# Altium schematic sheet WanderDrive_Gate_Driver_2.SchDoc (part 2 of 2)
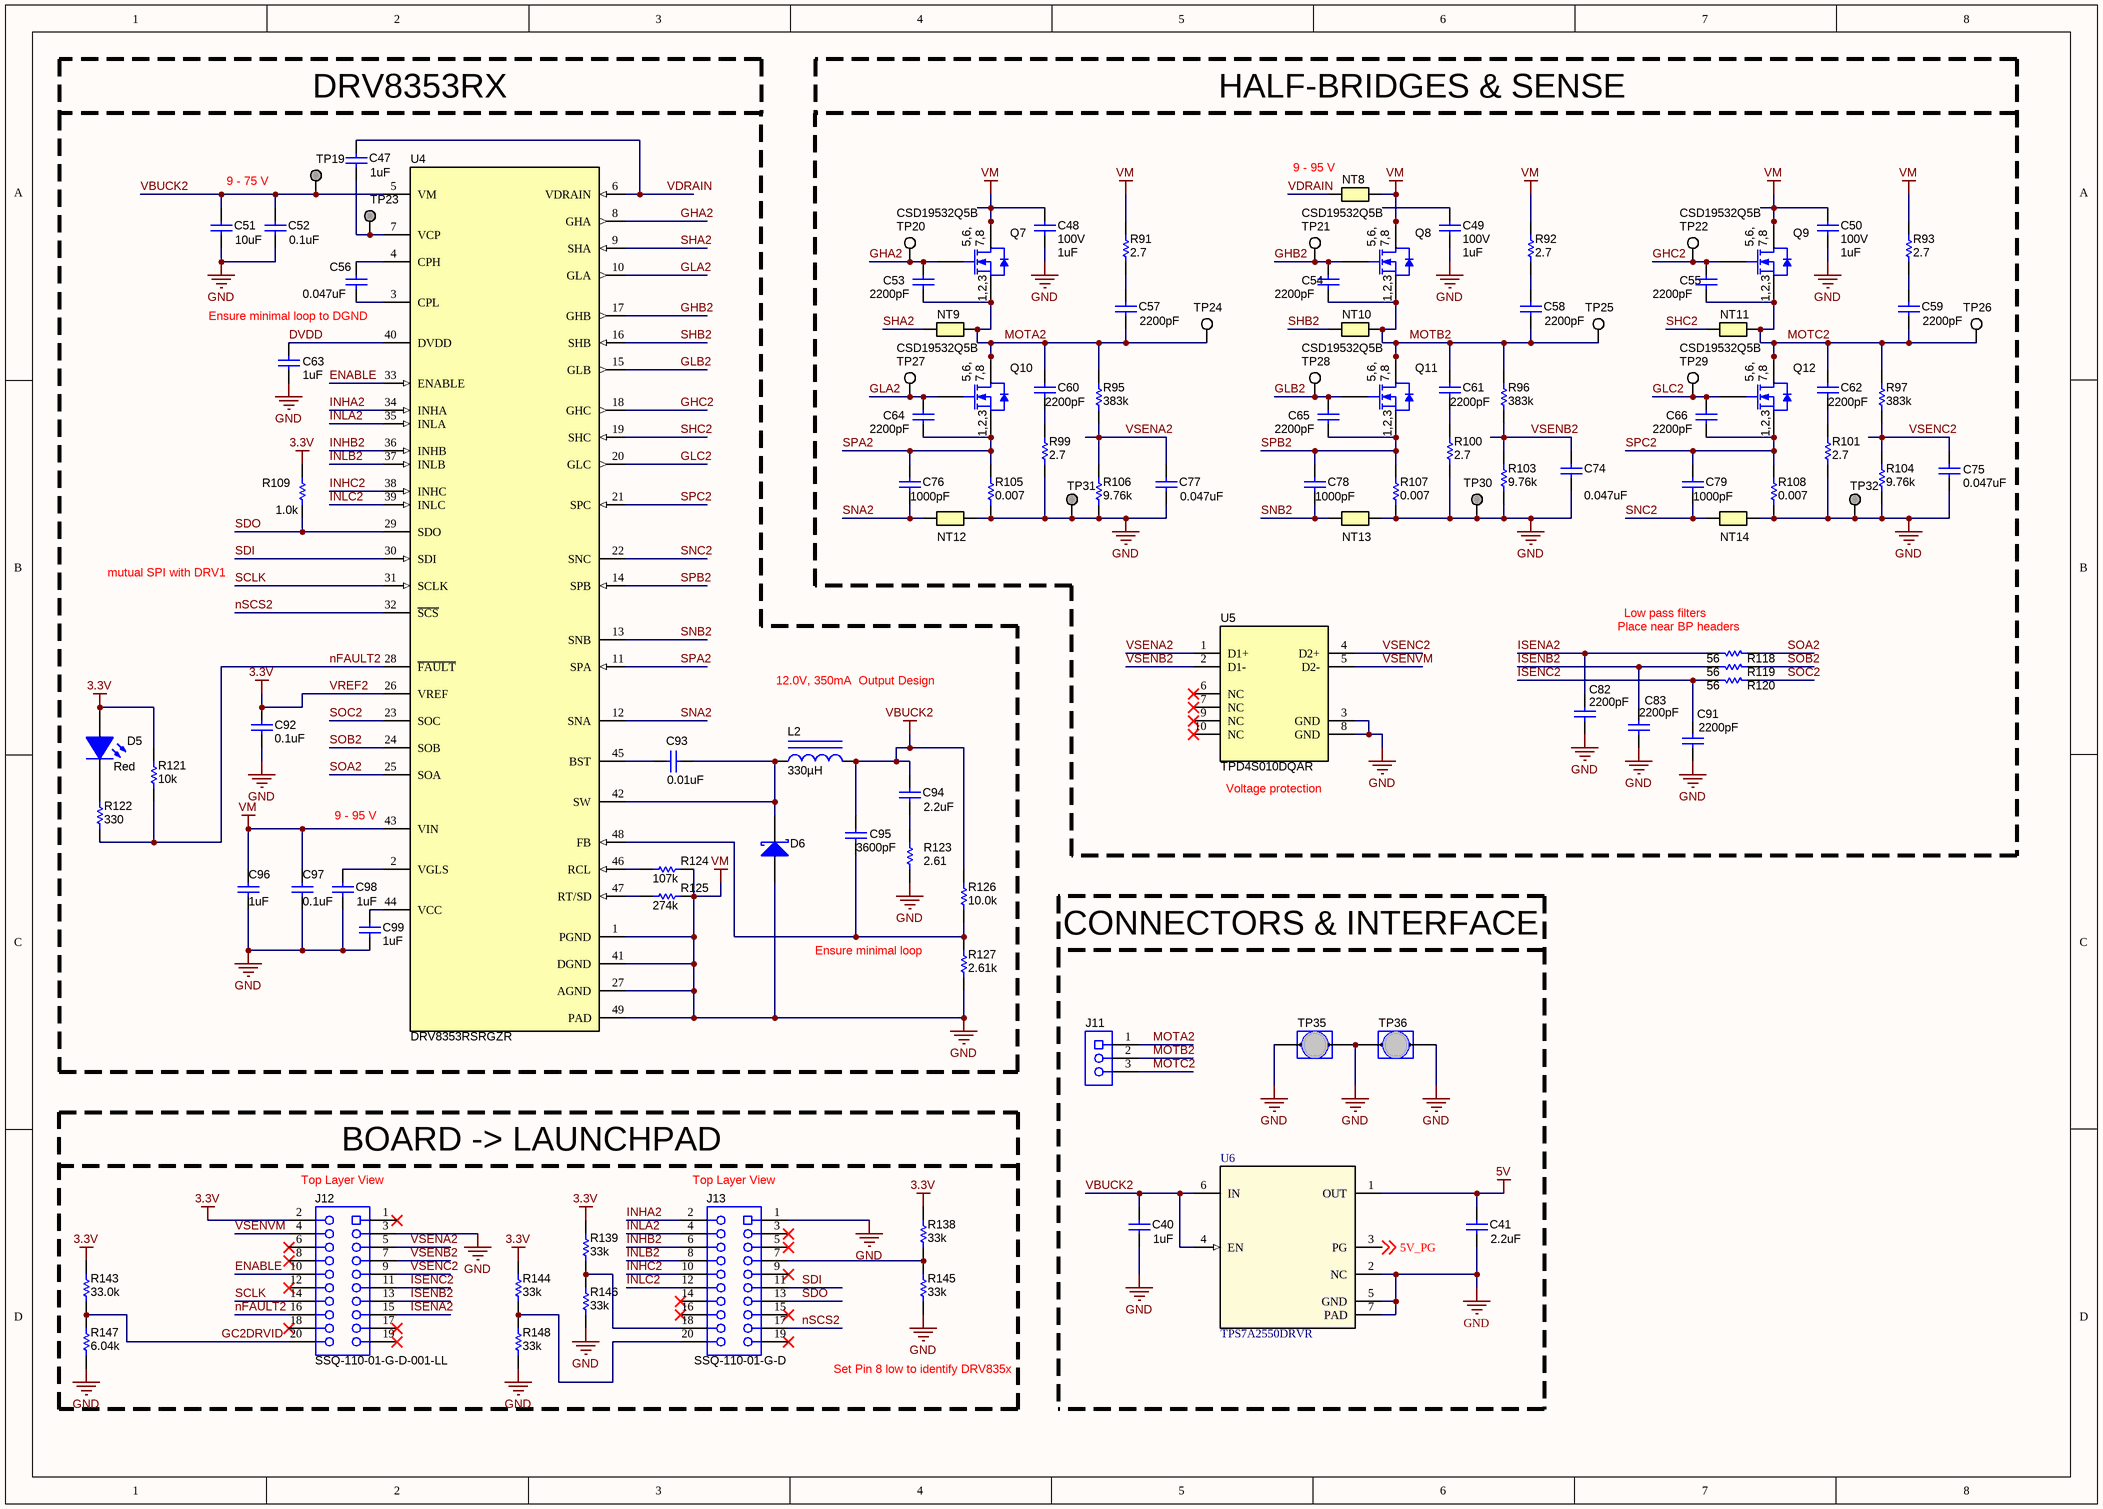
[diagram p1: WanderDrive_Gate_Driver_2.SchDoc]

## Library data of the parts
C40 = CMP-0007994-2: CAP, CERM, 1 uF, 50 V, +/- 10%, X7R, 0805; Manufacturer: Samsung Electro-Mechanics; TaMin_C: -55°C; Polarized: N; SizeAreaWB_mm2: 6.75; Value1: Unknown; U/M: EA; Value: 1uF; TaMax_C: 125°C; SizeZ_mm: 1.45; SizeX_mm: 2; SizeY_mm: 1.25; Cap_Case: 0805; Value2: 50V; SizeArea_mm2: 2.5; CompType: Capacitor; Cap_F: 1µF; AEC Category: Q200; Publisher: Texas Instruments; TempCo: X7R; Published: 2008-06-19; RoHS: Y; MountType: SMT; PackageReference: 0805; Tolerance_%: 10%; LatestRevisionDate: 2017-03-09; PartNumber: CL21B105KBFNNNE; AEC Qualified: ?; ComponentLink1Description: Datasheet link; Technology: Ceramic; ComponentLink1URL: http://www.samsungsem.com/servlet/FileDownload?type=spec&file=CL21B105KBFNNNE.pdf
C41 = CMP-0009230-2: CAP, CERM, 4.7 uF, 80 V, +/- 10%, X7R, 1210; Manufacturer: MuRata; TaMin_C: -55°C; Polarized: N; SizeAreaWB_mm2: 14.7; Value1: Unknown; U/M: EA; Value: 4.7uF; TaMax_C: 125°C; SizeZ_mm: 2.7; SizeX_mm: 3.2; SizeY_mm: 2.5; Cap_Case: 1210; Value2: 80V; SizeArea_mm2: 8; CompType: Capacitor; Cap_F: 4.7µF; AEC Category: Q200; Supplier Part Number 2: 81-GRM32ER71K475KE4L; Publisher: Texas Instruments; Supplier 2: Mouser; TempCo: X7R; Published: 2008-06-19; RoHS: Y; MountType: SMT; Supplier 1: Digi-Key; PackageReference: 1210; Tolerance_%: 10%; LatestRevisionDate: 2017-03-09; PartNumber: GRM32ER71K475KE14L; AEC Qualified: N; ComponentLink1Description: Datasheet link; AEC Grade: N/A; Supplier Part Number 1: 490-9972-1-ND; Technology: Ceramic; ComponentLink1URL: http://psearch.en.murata.com/capacitor/product/GRM32ER71K475KE14%23.pdf
C47 C96 = CMP-0008801-2: CAP, CERM, 1 uF, 100 V, +/- 10%, X7R, 1206; Manufacturer: Samsung; TaMin_C: -55°C; Polarized: N; SizeAreaWB_mm2: 10.92; Value1: Unknown; U/M: EA; Value: 1uF; TaMax_C: 125°C; SizeZ_mm: 1.8; SizeX_mm: 3.2; SizeY_mm: 1.6; Cap_Case: 1206; Value2: 100V; SizeArea_mm2: 5.12; CompType: Capacitor; Cap_F: 1µF; AEC Category: Q200; Publisher: Texas Instruments; TempCo: X7R; Published: 2008-06-19; RoHS: Y; MountType: SMT; Supplier 1: Digi-Key; PackageReference: 1206; Tolerance_%: 10%; LatestRevisionDate: 2017-03-09; PartNumber: CL31B105KCHNNNE; AEC Qualified: N; ComponentLink1Description: Datasheet link; AEC Grade: N/A; Supplier Part Number 1: 1276-1838-1-ND; Technology: Ceramic; ComponentLink1URL: http://www.samsungsem.com/kr/front/downloadcms.do?path=/kr/support/product-search/mlcc/__icsFiles/afieldfile/2014/11/05&fileName=C_CL31B105KCHNNNE.pdf
C48-C50 = CMP-0008801-2: CAP, CERM, 1 uF, 100 V, +/- 10%, X7R, 1206; Manufacturer: Samsung; TaMin_C: -55°C; Polarized: N; SizeAreaWB_mm2: 10.92; Value1: Unknown; U/M: EA; Value: 1uF; TaMax_C: 125°C; SizeZ_mm: 1.8; SizeX_mm: 3.2; SizeY_mm: 1.6; Cap_Case: 1206; SizeArea_mm2: 5.12; CompType: Capacitor; Cap_F: 1µF; AEC Category: Q200; Publisher: Texas Instruments; TempCo: X7R; Published: 2008-06-19; RoHS: Y; MountType: SMT; Supplier 1: Digi-Key; PackageReference: 1206; Tolerance_%: 10%; Value2: 100V; LatestRevisionDate: 2017-03-09; PartNumber: CL31B105KCHNNNE; AEC Qualified: N; ComponentLink1Description: Datasheet link; AEC Grade: N/A; Supplier Part Number 1: 1276-1838-1-ND; Technology: Ceramic; ComponentLink1URL: http://www.samsungsem.com/kr/front/downloadcms.do?path=/kr/support/product-search/mlcc/__icsFiles/afieldfile/2014/11/05&fileName=C_CL31B105KCHNNNE.pdf
C51 = CMP-0064964-2: CAP, CERM, 10 uF, 100 V,+/- 10%, X7S, AEC-Q200 Grade 1, 2220; Manufacturer: TDK; TaMin_C: -55°C; Polarized: N; SizeAreaWB_mm2: 53.9; Value1: Unknown; U/M: EA; Value: 10uF; TaMax_C: 125°C; SizeZ_mm: 2.8; SizeX_mm: 5.7; SizeY_mm: 5; Cap_Case: 2220; Value2: 100V; SizeArea_mm2: 28.5; CompType: Capacitor; AEC Qualified: Y; Cap_F: 10µF; AEC Grade: 1; AEC Category: Q200; Supplier Part Number 2: 80X3234; Publisher: Texas Instruments; Supplier 2: Newark; Supplier Part Number 3: 810-CGA9N3X7S2A106KS; TempCo: X7S; Supplier 3: Mouser; Published: 2008-06-19; RoHS: Y; MountType: SMT; Supplier 1: Digi-Key; PackageReference: 2220; Tolerance_%: 10%; LatestRevisionDate: 2017-06-05; PartNumber: CGA9N3X7S2A106K230KE; ComponentLink1Description: Datasheet link; Supplier Part Number 1: 445-8768-1-ND; Technology: Ceramic; ComponentLink1URL: https://product.tdk.com/info/en/catalog/datasheets/mlcc_automotive_soft_en.pdf
C52 C97 = CMP-0007886-2: CAP, CERM, 0.1 uF, 100 V, +/- 10%, X7R, 0805; Manufacturer: TDK; TaMin_C: -55°C; ESR_ohm: 0.020726; Polarized: N; SizeAreaWB_mm2: 6.75; Value1: 0.020726 ohm; U/M: EA; Value: 0.1uF; TaMax_C: 125°C; SizeZ_mm: 1.45; SizeX_mm: 2; SizeY_mm: 1.25; Cap_Case: 0805; Value2: 100V; SizeArea_mm2: 2.5; CompType: Capacitor; Cap_F: 100nF; IRMS_A: 1.456A; AEC Category: Q200; Supplier Part Number 2: 1844410; Publisher: Texas Instruments; Supplier 2: Farnell; TempCo: X7R; Published: 2008-06-19; RoHS: Y; MountType: SMT; Supplier 1: Digi-Key; PackageReference: 0805; Tolerance_%: 10%; LatestRevisionDate: 2017-03-09; PartNumber: C2012X7R2A104K125AA; AEC Qualified: N; ComponentLink1Description: Datasheet link; AEC Grade: N/A; Supplier Part Number 1: 445-1418-1-ND; Technology: Ceramic; ComponentLink1URL: https://product.tdk.com/en/search/capacitor/ceramic/mlcc/info?part_no=C2012X7R2A104K125AA
C53-C55 C64-C66 = CMP-0006737-4: CAP, CERM, 2200 pF, 100 V, +/- 10%, X7R, 0603; Manufacturer: AVX; TaMin_C: -55°C; ESR_ohm: 1.92d; Polarized: N; SizeAreaWB_mm2: 4.68; Value1: 0.192 ohm; U/M: EA; Value: 2200pF; TaMax_C: 125°C; SizeZ_mm: 1; SizeX_mm: 1.6; SizeY_mm: 0.8; Cap_Case: 0603; Value2: 100V; SizeArea_mm2: 1.28; CompType: Capacitor; Cap_F: 2.2nF; AEC Category: Q200; Supplier Part Number 2: 96K4759; Publisher: Texas Instruments; Supplier 2: Newark; Supplier Part Number 3: 581-06031C222K; TempCo: X7R; Supplier 3: Mouser; Published: 2008-06-19; RoHS: Y; MountType: SMT; Supplier 1: Digi-Key; PackageReference: 0603; Tolerance_%: 10%; LatestRevisionDate: 2017-03-09; PartNumber: 06031C222KAT2A; AEC Qualified: N; ComponentLink1Description: Datasheet link; AEC Grade: N/A; Supplier Part Number 1: 478-1201-1-ND; Technology: Ceramic; ComponentLink1URL: http://datasheets.avx.com/X7RDielectric.pdf
C56 = CMP-0007887-2: CAP, CERM, 0.047 uF, 100 V, +/- 10%, X7R, 0805; Manufacturer: TDK; Polarized: N; CompType: Capacitor; U/M: EA; Cap_F: 47nF; ESR_ohm: 0.049089; Value1: 0.049089 ohm; VDC_V: 100V; IRMS_A: 9.63171dA; TaMin_C: -55°C; TaMax_C: 125°C; Cap_Case: 0805; AEC Category: Q200; SizeArea_mm2: 2.5; SizeAreaWB_mm2: 6.75; SizeX_mm: 2; SizeY_mm: 1.25; SizeZ_mm: 1.45; Value: 0.047uF; PartNumber: C2012X7R2A473K125AA; PackageReference: 0805; RoHS: Y; Tolerance_%: 10%; Value2: 100V; MountType: SMT; Technology: Ceramic; TempCo: X7R; Published: 2008-06-19; Publisher: Texas Instruments; LatestRevisionDate: 2017-03-09; ComponentLink1Description: Datasheet link; ComponentLink1URL: https://product.tdk.com/en/search/capacitor/ceramic/mlcc/info?part_no=C2012X7R2A473K125AA; Supplier 1: Digi-Key; Supplier Part Number 1: 445-2276-1-ND; Supplier 2: Mouser; Supplier Part Number 2: 810-C2012X7R2A473K125AA; AEC Qualified: N; AEC Grade: N/A
C57-C62 = CMP-0007475-4: CAP, CERM, 2200 pF, 100 V, +/- 10%, X7R, 0603; Manufacturer: MuRata; TaMin_C: -55°C; Polarized: N; SizeAreaWB_mm2: 4.68; Value1: Unknown; U/M: EA; Value: 2200pF; TaMax_C: 125°C; SizeZ_mm: 1; SizeX_mm: 1.6; SizeY_mm: 0.8; Cap_Case: 0603; Value2: 100V; SizeArea_mm2: 1.28; CompType: Capacitor; Cap_F: 2.2nF; AEC Category: Q200; Supplier Part Number 2: 81-GRM188R72A222KA01; Publisher: Texas Instruments; Supplier 2: Mouser; TempCo: X7R; Published: 2008-06-19; RoHS: Y; MountType: SMT; Supplier 1: Digi-Key; PackageReference: 0603; Tolerance_%: 10%; LatestRevisionDate: 2017-03-09; PartNumber: GRM188R72A222KA01D; AEC Qualified: ?; ComponentLink1Description: Datasheet link; Supplier Part Number 1: 490-1478-1-ND; Technology: Ceramic; ComponentLink1URL: http://search.murata.co.jp/Ceramy/PnsearchViewAction.do?HnOFG=ON&HnNFG=ON&SEL_CNT=50&sLang=en&sKey=GRM188R72A222KA01D&x=9&y=9&search=startwith
C63 = CMP-0007120-4: CAP, CERM, 1 uF, 16 V, +/- 10%, X7R, 0603; Manufacturer: Taiyo Yuden; TaMin_C: -55°C; Polarized: N; SizeAreaWB_mm2: 4.68; Value1: Unknown; U/M: EA; Value: 1uF; TaMax_C: 85°C; SizeZ_mm: 1; SizeX_mm: 1.6; SizeY_mm: 0.8; Cap_Case: 0603; Value2: 16V; SizeArea_mm2: 1.28; CompType: Capacitor; Cap_F: 1µF; AEC Category: Q200; Publisher: Texas Instruments; TempCo: X7R; Published: 2008-06-19; RoHS: Y; MountType: SMT; Supplier 1: Farnell; PackageReference: 0603; Tolerance_%: 10%; LatestRevisionDate: 2017-03-09; PartNumber: EMK107B7105KA-T; AEC Qualified: ?; ComponentLink1Description: Datasheet link; Supplier Part Number 1: 1683647; Technology: Ceramic; ComponentLink1URL: http://www.yuden.co.jp/ut/product/pdf/djmk_e.pdf
C74 C75 C77 = CMP-0006757-5: CAP, CERM, 0.047 uF, 25 V, +/- 5%, X7R, 0603; Manufacturer: AVX; TaMin_C: -55°C; ESR_ohm: 0.052; Polarized: N; SizeAreaWB_mm2: 4.68; Value1: 0.052 ohm; U/M: EA; TaMax_C: 125°C; SizeZ_mm: 1; SizeX_mm: 1.6; SizeY_mm: 0.8; Cap_Case: 0603; Value2: 25V; SizeArea_mm2: 1.28; CompType: Capacitor; Cap_F: 47nF; AEC Category: Q200; Supplier Part Number 2: 96M1264; Publisher: Texas Instruments; Supplier 2: Newark; Supplier Part Number 3: 581-06033C473J; TempCo: X7R; Supplier 3: Mouser; Published: 2008-06-19; RoHS: Y; MountType: SMT; Value: 0.047uF; Supplier 1: Digi-Key; PackageReference: 0603; Tolerance_%: 5%; LatestRevisionDate: 2017-03-09; PartNumber: 06033C473JAT2A; AEC Qualified: N; ComponentLink1Description: Datasheet link; AEC Grade: N/A; Supplier Part Number 1: 478-3716-1-ND; Technology: Ceramic; ComponentLink1URL: http://datasheets.avx.com/X7RDielectric.pdf
C76 C78 C79 = CMP-0006826-4: CAP, CERM, 1000 pF, 16 V, +/- 10%, X7R, 0603; Manufacturer: Wurth Elektronik; TaMin_C: -55°C; Polarized: N; SizeAreaWB_mm2: 4.68; Value1: Unknown; U/M: EA; Value: 1000pF; TaMax_C: 125°C; SizeZ_mm: 1; SizeX_mm: 1.6; SizeY_mm: 0.8; Cap_Case: 0603; Value2: 16V; SizeArea_mm2: 1.28; CompType: Capacitor; Cap_F: 1nF; AEC Category: Q200; Publisher: Texas Instruments; TempCo: X7R; Published: 2008-06-19; RoHS: Y; MountType: SMT; Supplier 1: Mouser; PackageReference: 0603; Tolerance_%: 10%; LatestRevisionDate: 2017-03-09; PartNumber: 885012206034; AEC Qualified: N; ComponentLink1Description: Datasheet link; AEC Grade: N/A; Supplier Part Number 1: 710-885012206034; Technology: Ceramic; ComponentLink1URL: http://katalog.we-online.de/pbs/datasheet/885012206034.pdf
C82 = CMP-0007387-4: CAP, CERM, 2200 pF, 16 V, +/- 10%, X7R, 0603; Manufacturer: MuRata; Polarized: N; Value: 2200pF; U/M: EA; Cap_F: 2.2nF; Value1: Unknown; VDC_V: 16V; TaMin_C: -55°C; TaMax_C: 125°C; Cap_Case: 0603; SizeArea_mm2: 1.28; SizeAreaWB_mm2: 4.68; SizeX_mm: 1.6; SizeY_mm: 0.8; SizeZ_mm: 1; AEC Category: Q200; CompType: Capacitor; PartNumber: GRM188R71C222KA01D; PackageReference: 0603; RoHS: Y; Tolerance_%: 10%; Value2: 16V; MountType: SMT; Technology: Ceramic; TempCo: X7R; Published: 2008-06-19; Publisher: Texas Instruments; LatestRevisionDate: 2017-03-09; ComponentLink1Description: Datasheet link; ComponentLink1URL: http://search.murata.co.jp/Ceramy/PnsearchViewAction.do?HnOFG=ON&HnNFG=ON&SEL_CNT=50&sLang=en&sKey=GRM188R71C222KA01D&x=9&y=9&search=startwith; Supplier 1: Digi-Key; Supplier Part Number 1: GRM188R71C222KA01D-ND; Supplier 2: Mouser; Supplier Part Number 2: 81-GRM188R71C222KA1D; AEC Qualified: ?
C83 C91 = CMP-0007387-4: CAP, CERM, 2200 pF, 16 V, +/- 10%, X7R, 0603; Manufacturer: MuRata; Polarized: N; Value: 2200pF; U/M: EA; Cap_F: 2.2nF; Value1: Unknown; VDC_V: 16V; TaMin_C: -55°C; TaMax_C: 125°C; Cap_Case: 0603; AEC Category: Q200; SizeArea_mm2: 1.28; SizeAreaWB_mm2: 4.68; SizeX_mm: 1.6; SizeY_mm: 0.8; SizeZ_mm: 1; CompType: Capacitor; PartNumber: GRM188R71C222KA01D; PackageReference: 0603; RoHS: Y; Tolerance_%: 10%; Value2: 16V; MountType: SMT; Technology: Ceramic; TempCo: X7R; Published: 2008-06-19; Publisher: Texas Instruments; LatestRevisionDate: 2017-03-09; ComponentLink1Description: Datasheet link; ComponentLink1URL: http://search.murata.co.jp/Ceramy/PnsearchViewAction.do?HnOFG=ON&HnNFG=ON&SEL_CNT=50&sLang=en&sKey=GRM188R71C222KA01D&x=9&y=9&search=startwith; Supplier 1: Digi-Key; Supplier Part Number 1: GRM188R71C222KA01D-ND; Supplier 2: Mouser; Supplier Part Number 2: 81-GRM188R71C222KA1D; AEC Qualified: ?
C92 = CMP-0006857-4: CAP, CERM, 0.1 uF, 16 V, +/- 5%, X7R, 0603; Manufacturer: Kemet; Polarized: N; CompType: Capacitor; Value: 0.1uF; U/M: EA; Cap_F: 100nF; Value1: Unknown; VDC_V: 16V; TaMin_C: -55°C; TaMax_C: 125°C; Cap_Case: 0603; AEC Category: Q200; SizeArea_mm2: 1.28; SizeAreaWB_mm2: 4.68; SizeX_mm: 1.6; SizeY_mm: 0.8; SizeZ_mm: 1; PartNumber: C0603C104J4RACTU; PackageReference: 0603; RoHS: Y; Tolerance_%: 5%; Value2: 16V; MountType: SMT; Technology: Ceramic; TempCo: X7R; Published: 2008-06-19; Publisher: Texas Instruments; LatestRevisionDate: 2017-03-09; ComponentLink1Description: Datasheet link; ComponentLink1URL: http://www.kemet.com/kemet/web/homepage/kechome.nsf/vapubfiles/F3102_Y5V.pdf/$file/F3102_Y5V.pdf; Supplier 1: Digi-Key; Supplier Part Number 1: 399-1097-1-ND; Supplier 2: Mouser; Supplier Part Number 2: 80-C0603C104J4R; Supplier 3: Farnell; Supplier Part Number 3: 1650834; AEC Qualified: ?
C93 = CMP-0006853-4: CAP, CERM, 0.01 uF, 16 V, +/- 10%, X7R, 0603; Manufacturer: Kemet; TaMin_C: -55°C; Polarized: N; SizeAreaWB_mm2: 4.68; Value1: Unknown; U/M: EA; Value: 0.01uF; TaMax_C: 125°C; SizeZ_mm: 1; SizeX_mm: 1.6; SizeY_mm: 0.8; Cap_Case: 0603; Value2: 16V; SizeArea_mm2: 1.28; CompType: Capacitor; Cap_F: 10nF; AEC Category: Q200; Supplier Part Number 2: 90C0378; Publisher: Texas Instruments; Supplier 2: Newark; Supplier Part Number 3: 80-C0603C103K4R; TempCo: X7R; Supplier 3: Mouser; Published: 2008-06-19; RoHS: Y; MountType: SMT; Supplier 1: Digi-Key; PackageReference: 0603; Tolerance_%: 10%; LatestRevisionDate: 2017-03-09; PartNumber: C0603C103K4RACTU; AEC Qualified: N; ComponentLink1Description: Datasheet link; AEC Grade: N/A; Supplier Part Number 1: 399-7841-1-ND; Technology: Ceramic; ComponentLink1URL: http://www.kemet.com/docfinder?Partnumber=C0603C103K4RACTU
C94 = CMP-0007883-2: CAP, CERM, 2.2 uF, 35 V, +/- 10%, X7R, 0805; Manufacturer: TDK; TaMin_C: -55°C; Polarized: N; SizeAreaWB_mm2: 6.75; Value1: Unknown; U/M: EA; Value: 2.2uF; TaMax_C: 125°C; SizeZ_mm: 1.45; SizeX_mm: 2; SizeY_mm: 1.25; Cap_Case: 0805; Value2: 35V; SizeArea_mm2: 2.5; CompType: Capacitor; Cap_F: 2.2µF; AEC Category: Q200; Supplier Part Number 2: 52X4254; Publisher: Texas Instruments; Supplier 2: Newark; TempCo: X7R; Published: 2008-06-19; RoHS: Y; MountType: SMT; Supplier 1: Digi-Key; PackageReference: 0805; Tolerance_%: 10%; LatestRevisionDate: 2017-03-09; PartNumber: C2012X7R1V225K085AC; AEC Qualified: ?; ComponentLink1Description: Datasheet link; Supplier Part Number 1: 445-14547-1-ND; Technology: Ceramic; ComponentLink1URL: http://product.tdk.com/en/catalog/datasheets/mlcc_commercial_general_en.pdf
C95 = CMP-0007213-4: CAP, CERM, 3600 pF, 50 V, +/- 5%, C0G/NP0, 0603; Manufacturer: MuRata; TaMin_C: -55°C; Polarized: N; SizeAreaWB_mm2: 4.68; Value1: Unknown; U/M: EA; Value: 3600pF; TaMax_C: 125°C; SizeZ_mm: 1; SizeX_mm: 1.6; SizeY_mm: 0.8; Cap_Case: 0603; Value2: 50V; SizeArea_mm2: 1.28; CompType: Capacitor; Cap_F: 3.6nF; AEC Category: Q200; Supplier Part Number 2: 81-GRM1885C1H362JA1D; Publisher: Texas Instruments; Supplier 2: Mouser; TempCo: C0G/NP0; Published: 2008-06-19; RoHS: Y; MountType: SMT; Supplier 1: Digi-Key; PackageReference: 0603; Tolerance_%: 5%; LatestRevisionDate: 2017-03-09; PartNumber: GRM1885C1H362JA01D; AEC Qualified: ?; ComponentLink1Description: Datasheet link; Supplier Part Number 1: GRM1885C1H362JA01D-ND; Technology: Ceramic; ComponentLink1URL: http://search.murata.co.jp/Ceramy/PnsearchViewAction.do?HnOFG=ON&HnNFG=ON&SEL_CNT=50&sLang=en&sKey=GRM1885C1H362JA01D&x=9&y=9&search=startwith
C98 C99 = CMP-0007037-4: CAP, CERM, 1 uF, 16 V, +/- 10%, X7R, 0603; Manufacturer: TDK; TaMin_C: -55°C; ESR_ohm: 5.7m; Polarized: N; SizeAreaWB_mm2: 4.68; Value1: 0.0057 ohm; U/M: EA; Value: 1uF; TaMax_C: 125°C; SizeZ_mm: 1; SizeX_mm: 1.6; SizeY_mm: 0.8; Cap_Case: 0603; Value2: 16V; SizeArea_mm2: 1.28; CompType: Capacitor; Cap_F: 1µF; AEC Category: Q200; Supplier Part Number 2: 90R7686; Publisher: Texas Instruments; Supplier 2: Newark; Supplier Part Number 3: 810-C1608X7R1C105K; TempCo: X7R; Supplier 3: Mouser; Published: 2008-06-19; RoHS: Y; MountType: SMT; Supplier 1: Digi-Key; PackageReference: 0603; Tolerance_%: 10%; LatestRevisionDate: 2017-03-09; PartNumber: C1608X7R1C105K080AC; AEC Qualified: ?; ComponentLink1Description: Datasheet link; Supplier Part Number 1: 445-1604-1-ND; Technology: Ceramic; ComponentLink1URL: http://www.tdk.co.jp/tefe02/e412_c.pdf
D5 = CMP-0002829-2: LED, Red, SMD; Manufacturer: Lite-On; Io_A: 20mA; SizeAreaWB_mm2: 6.75; Value1: W; U/M: EA; SizeZ_mm: 1.2; SizeX_mm: 2; SizeY_mm: 1.25; Vf_V: 2V; SizeArea_mm2: 2.5; Type: AlInGaP; Supplier Part Number 2: 859-LTST-C170KRKT; Publisher: Texas Instruments; Supplier 2: Mouser; Color: red; Published: 2008-07-11; RoHS: Y; MountType: SMT; Supplier 1: Digi-Key; PackageReference: Red 0805 LED; Value2: 2V; CompType: LED; LatestRevisionDate: 2017-03-09; PartNumber: LTST-C170KRKT; ComponentLink1Description: Datasheet link; Supplier Part Number 1: 160-1415-1-ND; ComponentLink1URL: http://optoelectronics.liteon.com/upload/download/DS-22-99-0150/P_100_LTST-C170KRKT.pdf
D6 = CMP-0028517-1: Diode, Schottky, 200 V, 1 A, PowerDI123; Manufacturer: Diodes Inc.; Io_A: 1A; Green_Lifecycle: Active; SizeAreaWB_mm2: 13.066; Vr_V: 200V; Green_REACh: Passed; TJmax_C: 175°C; U/M: EA; Value: 200V; SizeZ_mm: 0.98; SizeX_mm: 3.7; SizeY_mm: 1.78; Vf_V: 8.5dV; Value2: 0.85V; SizeArea_mm2: 6.586; AEC Category: Q101; RJC_CperW: 7; ComponentLink1URL: http://www.diodes.com/datasheets/ds30628.pdf; Supplier Part Number 2: 621-DFLS1200-F; Publisher: Texas Instruments; Supplier 2: Mouser; Supplier Part Number 3: 1713890; Supplier 3: Farnell; Published: 2008-06-26; RoHS: Y; Value1: 1A; MountType: SMT; Green_EU RoHS-2: Passed; Supplier 1: Digi-Key; Green_EU RoHS: Passed with Exemption; PackageReference: PowerDI123; CompType: Diode; Type: Schottky; LatestRevisionDate: 2017-05-08; PartNumber: DFLS1200-7; AEC Qualified: ?; ComponentLink1Description: Datasheet link; Supplier Part Number 1: DFLS1200DICT-ND
J11 = CMP-0055528-1: Terminal Block, 9.52mm, 3x1, R/A, TH; Manufacturer: Phoenix Contact; Pitch_mm: 9.52; Gender: Female; Row_Count: 1; Current_A: 32A; Voltage_V: 1kV; Cert_UL: Y; CNHeader: FALSE; CT: TRUE; PartNumber: 1904150; PackageReference: Terminal Block, 3x1, Pitch 9.52mm; CompType: Terminal Block; RoHS: Y; MountType: TH; ComponentLink1Description: Datasheet URL; ComponentLink1URL: https://www.phoenixcontact.com/online/portal/in?uri=pxc-oc-itemdetail:pid=1904150&library=inen&pcck=P-11-01-05&tab=1; Publisher: Texas Instruments; LatestRevisionDate: 26/05/2017; Supplier 1: Digi-Key; Supplier Part Number 1: 277-6184-ND; Supplier 2: Newark; Supplier Part Number 2: 15X2516; Supplier 3: Mouser; Supplier Part Number 3: 651-1904150; Orientation: R/A; PinCount: 3; Color: Green; Cert_VDE: Y
J12 = CMP-0082628-1: Receptacle, 2.54mm, 10x2, Gold, TH; Manufacturer: Samtec; Pitch_mm: 2.54; Gender: Female; Cert_UL: Y; Voltage_V: 465V; Current_A: 6.3A; Row_Count: 2; CompType: Socket Strip; ComponentLink1Description: Datasheet URL; RoHS: Y; Orientation: Vertical; PackageReference: Receptacle, 2.54mm, 10x2, TH; Color: Black; PartNumber: SSQ-110-01-G-D-001-LL; PinCount: 20; ContactFinish: Gold; RowSpacing_mm: 2.54; ComponentLink1URL: http://suddendocs.samtec.com/catalog_english/ssq_th.pdf; MountType: TH
J13 = CMP-0082605-1: Receptacle, 2.54mm, 10x2, Gold, TH; Manufacturer: Samtec; Pitch_mm: 2.54; Gender: Female; Cert_UL: Y; Voltage_V: 465V; Current_A: 6.3A; Row_Count: 2; CompType: Socket Strip; ComponentLink1Description: Datasheet URL; RoHS: Y; Supplier Part Number 3: 1668306; Supplier 1: Digi-Key; Orientation: Vertical; PackageReference: Receptacle, 2.54mm, 10x2, TH; Color: Black; PartNumber: SSQ-110-01-G-D; PinCount: 20; Supplier Part Number 2: 11P8367; ContactFinish: Gold; Supplier 2: Newark; RowSpacing_mm: 2.54; ComponentLink1URL: http://suddendocs.samtec.com/prints/ssq-1xx-xx-xxx-x-xx-xxx-xx-x-mkt.pdf; MountType: TH; Supplier Part Number 1: SAM1179-10-ND; Supplier 3: Farnell
L2 = CMP-0080995-1: Inductor, Shielded, 330 µH, 0.66 A, 1.1245 ohm, SMD; Manufacturer: Wurth Elektronik; SizeAreaWB_mm2: 100; Irms: 0.66A @ 40C rise; SizeArea_mm2: 64; AEC Qualified: N; AEC Category: Q200; Value: 330uH; SizeZ_mm: 4.2; Imax_A: 6.6dA; SizeY_mm: 8; Value2: 0.66A; Isat: 0.9A @ 30% inductance drop; DCR_ohm: 1.1245; ComponentLink1Description: Datasheet link; RoHS: Y; Supplier 1: Digi-Key; PackageReference: 8x8mm; Technology: Shielded; Ind_H: 330µH; PartNumber: 74404084331; Supplier Part Number 2: 710-74404084331; Supplier 2: Mouser; AEC Grade: N/A; ComponentLink1URL: http://katalog.we-online.de/pbs/datasheet/74404084331.pdf; Value1: 1.1245 ohm; CompType: Inductor; MountType: SMT; Supplier Part Number 1: 732-7267-1-ND; Material: ?; SizeX_mm: 8
NT8-NT14 = CMP-0078142-1: Single point connection between nets.; MountType: SMT; PackageReference: N/A; CompType: Net-Tie; Manufacturer: N/A; PartNumber: N/A; Library Reference: Net-Tie
Q7-Q12 = CMP-0000958-3: MOSFET, N-CH, 100 V, 17 A, DNK0008A (VSON-CLIP-8); Manufacturer: Texas Instruments; Alternate Manufacturer: None; U/M: EA; ChType: N; Value: 100V; Value2: 48 nC; QgTyp_nC: 48; Vgs_V: 20V; IdsMax_A: 17A; SizeAreaWB_mm2: 56; SizeArea_mm2: 30; SizeX_mm: 6; SizeY_mm: 5; SizeZ_mm: 1; AEC Category: Q101; CompType: MOSFET; PartNumber: CSD19532Q5B; PackageReference: DNK0008A; VdsMax_V: 100V; RoHS: Y; MountType: SMT; ComponentLink1Description: Datasheet link; ComponentLink1URL: http://www.ti.com/lit/ds/symlink/csd19532q5b.pdf; Supplier 1: Digi-Key; Supplier Part Number 1: 296-37478-6-ND; Supplier 2: Farnell; Supplier Part Number 2: 2413268; AEC Qualified: N
R91-R93 R99-R101 = CMP-0020521-2: RES, 2.7, 5%, 0.125 W, 0805; Manufacturer: Vishay-Dale; Power_W: 125mW; TempCo: 200 ppm/C; Value_Code: 2R70; U/M: EA; Value: 2.7; EIA_Code: E24; SizeX_mm: 2; SizeY_mm: 1.25; SizeZ_mm: 1.45; Value2: 0.125W; SizeArea_mm2: 2.5; CompType: Resistor; VDC_V: 150V; AEC Category: Q200; Supplier Part Number 2: 71-CRCW08052R70JNEA; Publisher: Texas Instruments; Supplier 2: Mouser; Supplier Part Number 3: 1739195; Supplier 3: Farnell; Published: 2008-06-26; RoHS: Y; Value1: 5%; MountType: SMT; Supplier 1: Digi-Key; PackageReference: 0805; Tolerance_%: 5%; Res_ohm: 2.7; LatestRevisionDate: 2017-03-09; PartNumber: CRCW08052R70JNEA; AEC Qualified: ?; ComponentLink1Description: Datasheet link; Supplier Part Number 1: 541-2.7ACT-ND; Technology: Thick Film; ComponentLink1URL: http://www.vishay.com/docs/20035/dcrcwe3.pdf
R95-R97 = CMP-0022362-4: RES, 383 k, 1%, 0.1 W, AEC-Q200 Grade 0, 0603; Manufacturer: Vishay-Dale; Power_W: 100mW; TempCo: 100 ppm/C; Value: 383k; EIA_Code: E96; SizeX_mm: 1.6; SizeY_mm: 0.8; SizeZ_mm: 1; Value2: 0.1W; SizeArea_mm2: 1.28; CompType: Resistor; AEC Qualified: Y; VDC_V: 75V; AEC Category: Q200; AEC Grade: 0; Supplier Part Number 2: 42K3884; Supplier 2: Newark; Supplier Part Number 3: 71-CRCW0603-383K-E3; Supplier 3: Mouser; Value_Code: 383k; RoHS: E; Value1: 1%; MountType: SMT; Supplier 1: Digi-Key; PackageReference: 0603; Tolerance_%: 1%; Res_ohm: 383k; PartNumber: CRCW0603383KFKEA; ComponentLink1Description: Datasheet link; Supplier Part Number 1: 541-383KHCT-ND; Technology: Thick Film; ComponentLink1URL: http://www.vishay.com/docs/20035/dcrcwe3.pdf
R103 R104 R106 = CMP-0023336-5: RES, 9.76 k, 1%, 0.1 W, 0603; Manufacturer: Yageo; Power_W: 100mW; TempCo: 100 ppm/C; Value_Code: 9k76; Value: 9.76k; EIA_Code: E96; SizeX_mm: 1.6; SizeY_mm: 0.8; SizeZ_mm: 1; Value2: 0.1W; SizeArea_mm2: 1.28; CompType: Resistor; AEC Qualified: N; VDC_V: 75V; AEC Category: Q200; SizeAreaWB_mm2: 4.68; Supplier Part Number 2: 603-RC0603FR-079K76L; Supplier 2: Mouser; RoHS: Y; Value1: 1%; MountType: SMT; Supplier 1: Digi-Key; PackageReference: 0603; Tolerance_%: 1%; Res_ohm: 9.76k; PartNumber: RC0603FR-079K76L; ComponentLink1Description: Datasheet link; Supplier Part Number 1: 311-9.76KHRCT-ND; Technology: Thick Film; ComponentLink1URL: http://www.yageo.com/pdf/Pu-RC0603_51_PbFree_L_2.pdf; AEC Grade: N/A
R105 R107 R108 = CMP-0074664-1: RES, 0.007, 1%, 3 W, AEC-Q200 Grade 0, 2512; Manufacturer: Bourns; Value: 0.007; Res_ohm: 7m; Value_Code: 7L000; Power_W: 3W; TempCo: 50 ppm/C; EIA_Code: E96; U/M: EA; AEC Category: Q200; AEC Grade: 0; AEC Qualified: Y; Green_Lifecycle: Active; Green_REACh: Passed; SizeArea_mm2: 21.6075; SizeX_mm: 6.45; SizeY_mm: 3.35; SizeZ_mm: 0.9; CompType: Resistor; PartNumber: CRE2512-FZ-R007E-3; PackageReference: 2512; RoHS: Y; Tolerance_%: 1%; Value1: 1%; Value2: 3W; MountType: SMT; Technology: Metal Film; Published: 2008-06-26; Publisher: Texas Instruments; LatestRevisionDate: 2017-06-26; ComponentLink1Description: Datasheet link; ComponentLink1URL: http://www.bourns.com/docs/Product-Datasheets/CRE.pdf; Supplier 1: Digi-Key; Supplier Part Number 1: CRE2512-FZ-R007E-3CT-ND; Supplier 2: Newark; Supplier Part Number 2: 78X4876; Supplier 3: Mouser; Supplier Part Number 3: 652-CRE2512FZR007E-3; Green_EU RoHS-2: Incomplete; Green_EU RoHS: Passed
R109 = CMP-0025946-3: RES, 1.0 k, 5%, 0.1 W, AEC-Q200 Grade 0, 0603; Manufacturer: Vishay-Dale; Power_W: 100mW; TempCo: 200 ppm/C; Value_Code: 1k00; U/M: EA; Value: 1.0k; EIA_Code: E24; Res_ohm: 1k; SizeX_mm: 1.6; SizeY_mm: 0.8; SizeZ_mm: 1; Value2: 0.1W; SizeArea_mm2: 1.28; CompType: Resistor; AEC Qualified: Y; VDC_V: 75V; AEC Grade: 0; AEC Category: Q200; Supplier Part Number 2: 19T6578; Publisher: Texas Instruments; Supplier 2: Newark; Published: 2008-06-26; RoHS: Y; Value1: 5%; MountType: SMT; Supplier 1: Digi-Key; PackageReference: 0603; Tolerance_%: 5%; LatestRevisionDate: 2017-03-09; PartNumber: RCA06031K00JNEA; ComponentLink1Description: Datasheet link; Supplier Part Number 1: 541-2213-1-ND; Technology: Thick Film; ComponentLink1URL: http://www.vishay.com/docs/20037/rcae3.pdf
R118-R120 = CMP-0025829-4: RES, 56, 5%, 0.1 W, AEC-Q200 Grade 0, 0603; Manufacturer: Vishay-Dale; Value_Code: 56R0; Power_W: 100mW; Value2: 0.1W; VDC_V: 75V; TempCo: 200 ppm/C; EIA_Code: E24; AEC Category: Q200; AEC Qualified: Y; AEC Grade: 0; SizeArea_mm2: 1.28; SizeX_mm: 1.6; SizeY_mm: 0.8; SizeZ_mm: 1; CompType: Resistor; PartNumber: CRCW060356R0JNEA; PackageReference: 0603; RoHS: E; Res_ohm: 56; Tolerance_%: 5%; Value1: 5%; MountType: SMT; Technology: Thick Film; ComponentLink1Description: Datasheet link; ComponentLink1URL: http://www.vishay.com/docs/20035/dcrcwe3.pdf; Supplier 1: Digi-Key; Supplier Part Number 1: 541-56GCT-ND; Supplier 2: Newark; Supplier Part Number 2: 59M6825; Supplier 3: Mouser; Supplier Part Number 3: 71-CRCW0603J-56-E3; ValueDisplayed: 56
R121 = CMP-0025886-3: RES, 10 k, 5%, 0.1 W, 0603; Manufacturer: Yageo America; Power_W: 100mW; TempCo: 100 ppm/C; Value_Code: 10k0; U/M: EA; Value: 10k; EIA_Code: E24; SizeX_mm: 1.6; SizeY_mm: 0.8; SizeZ_mm: 1; Value2: 0.1W; SizeArea_mm2: 1.28; CompType: Resistor; VDC_V: 50V; AEC Category: Q200; Supplier Part Number 2: 603-RC0603JR-0710KL; Publisher: Texas Instruments; Supplier 2: Mouser; Supplier Part Number 3: 9233504; Supplier 3: Farnell; Published: 2008-06-26; RoHS: Y; Value1: 5%; MountType: SMT; Supplier 1: Digi-Key; PackageReference: 0603; Tolerance_%: 5%; Res_ohm: 10k; LatestRevisionDate: 2017-03-09; PartNumber: RC0603JR-0710KL; AEC Qualified: ?; ComponentLink1Description: Datasheet link; Supplier Part Number 1: 311-10KGRCT-ND; Technology: Thick Film; ComponentLink1URL: http://www.yageo.com/pdf/Pu-RC0603_51_PbFree_L_2.pdf
R122 = CMP-0025785-4: RES, 330, 5%, 0.1 W, AEC-Q200 Grade 0, 0603; Manufacturer: Vishay-Dale; Power_W: 100mW; TempCo: 200 ppm/C; Value_Code: 330R; Value: 330; EIA_Code: E24; SizeX_mm: 1.6; SizeY_mm: 0.8; SizeZ_mm: 1; Value2: 0.1W; SizeArea_mm2: 1.28; CompType: Resistor; AEC Qualified: Y; VDC_V: 75V; AEC Category: Q200; AEC Grade: 0; Supplier Part Number 2: 59M6805; Supplier 2: Newark; Supplier Part Number 3: 71-CRCW0603J-330-E3; Supplier 3: Mouser; RoHS: E; Value1: 5%; MountType: SMT; Supplier 1: Digi-Key; PackageReference: 0603; Tolerance_%: 5%; Res_ohm: 330; PartNumber: CRCW0603330RJNEA; ComponentLink1Description: Datasheet link; Supplier Part Number 1: 541-330GCT-ND; Technology: Thick Film; ComponentLink1URL: http://www.vishay.com/docs/20035/dcrcwe3.pdf
R123 = CMP-0022313-4: RES, 2.61, 1%, 0.1 W, AEC-Q200 Grade 0, 0603; Manufacturer: Vishay-Dale; Power_W: 100mW; TempCo: 100 ppm/C; Value_Code: 2R61; Value: 2.61; EIA_Code: E96; SizeX_mm: 1.6; SizeY_mm: 0.8; SizeZ_mm: 1; Value2: 0.1W; SizeArea_mm2: 1.28; CompType: Resistor; AEC Qualified: Y; VDC_V: 75V; AEC Category: Q200; AEC Grade: 0; Supplier Part Number 2: 71-CRCW06032R61FKEA; Supplier 2: Mouser; RoHS: E; Value1: 1%; MountType: SMT; Supplier 1: Digi-Key; PackageReference: 0603; Tolerance_%: 1%; Res_ohm: 2.61; PartNumber: CRCW06032R61FKEA; ComponentLink1Description: Datasheet link; Supplier Part Number 1: 541-2.61HHCT-ND; Technology: Thick Film; ComponentLink1URL: http://www.vishay.com/docs/20035/dcrcwe3.pdf
R124 = CMP-0022741-2: RES, 107 k, 1%, 0.1 W, 0603; Manufacturer: Yageo America; Power_W: 100mW; TempCo: 200 ppm/C; U/M: EA; Value: 107k; EIA_Code: E96; SizeX_mm: 1.6; SizeY_mm: 0.8; SizeZ_mm: 1; Value2: 0.1W; SizeArea_mm2: 1.28; CompType: Resistor; VDC_V: 150V; AEC Category: Q200; ComponentLink1URL: http://www.yageo.com/pdf/Pu-RC0603_51_PbFree_L_2.pdf; Supplier Part Number 2: 603-RC0603FR-07107KL; Publisher: Texas Instruments; Supplier 2: Mouser; Supplier Part Number 3: 9238247; Supplier 3: Farnell; Published: 2008-06-26; Value_Code: 107k; RoHS: Y; Value1: 1%; MountType: SMT; Supplier 1: Digi-Key; PackageReference: 0603; Tolerance_%: 1%; Res_ohm: 107k; LatestRevisionDate: 2017-03-09; PartNumber: RC0603FR-07107KL; AEC Qualified: ?; ComponentLink1Description: Datasheet link; Supplier Part Number 1: 311-107KHRCT-ND; Technology: Thick Film
R125 = CMP-0022963-2: RES, 274 k, 1%, 0.1 W, 0603; Manufacturer: Yageo America; Power_W: 100mW; TempCo: 200 ppm/C; U/M: EA; Value: 274k; EIA_Code: E96; SizeX_mm: 1.6; SizeY_mm: 0.8; SizeZ_mm: 1; Value2: 0.1W; SizeArea_mm2: 1.28; CompType: Resistor; VDC_V: 150V; AEC Category: Q200; ComponentLink1URL: http://www.yageo.com/pdf/Pu-RC0603_51_PbFree_L_2.pdf; Supplier Part Number 2: 603-RC0603FR-07274KL; Publisher: Texas Instruments; Supplier 2: Mouser; Supplier Part Number 3: 9238298; Supplier 3: Farnell; Published: 2008-06-26; Value_Code: 274k; RoHS: Y; Value1: 1%; MountType: SMT; Supplier 1: Digi-Key; PackageReference: 0603; Tolerance_%: 1%; Res_ohm: 274k; LatestRevisionDate: 2017-03-09; PartNumber: RC0603FR-07274KL; AEC Qualified: ?; ComponentLink1Description: Datasheet link; Supplier Part Number 1: 311-274KHRCT-ND; Technology: Thick Film
R126 = CMP-0023404-3: RES, 10.0 k, 0.1%, 0.1 W, 0603; Manufacturer: Susumu Co Ltd; Power_W: 100mW; TempCo: 25 ppm/C; Value_Code: 10k0; U/M: EA; Value: 10.0k; EIA_Code: E192; Res_ohm: 10k; SizeX_mm: 1.6; SizeY_mm: 0.8; SizeZ_mm: 1; Value2: 0.1W; SizeArea_mm2: 1.28; CompType: Resistor; VDC_V: 75V; AEC Category: Q200; Supplier Part Number 2: 754-RG1608P-103-B-T5; Publisher: Texas Instruments; Supplier 2: Mouser; Supplier Part Number 3: 1797079; Supplier 3: Farnell; Published: 2008-06-26; RoHS: Y; Value1: 0.1%; MountType: SMT; Supplier 1: Digi-Key; PackageReference: 0603; Tolerance_%: 0.1%; LatestRevisionDate: 2017-03-09; PartNumber: RG1608P-103-B-T5; AEC Qualified: ?; ComponentLink1Description: Datasheet link; Supplier Part Number 1: RG16P10.0KBCT-ND; Technology: Metal Film; ComponentLink1URL: http://www.susumu.co.jp/english/pdf/products-j01-01.pdf
R127 = CMP-0023494-3: RES, 2.61 k, 0.1%, 0.1 W, 0603; Manufacturer: Susumu Co Ltd; Power_W: 100mW; TempCo: 25 ppm/C; Value_Code: 2k61; U/M: EA; Value: 2.61k; EIA_Code: E192; SizeX_mm: 1.6; SizeY_mm: 0.8; SizeZ_mm: 1; Value2: 0.1W; SizeArea_mm2: 1.28; CompType: Resistor; VDC_V: 75V; AEC Category: Q200; Supplier Part Number 2: 754-RG1608P-2611-BT5; Publisher: Texas Instruments; Supplier 2: Mouser; Supplier Part Number 3: 1797144; Supplier 3: Farnell; Published: 2008-06-26; RoHS: Y; Value1: 0.1%; MountType: SMT; Supplier 1: Digi-Key; PackageReference: 0603; Tolerance_%: 0.1%; Res_ohm: 2.61k; LatestRevisionDate: 2017-03-09; PartNumber: RG1608P-2611-B-T5; ComponentLink1Description: Datasheet link; Supplier Part Number 1: RG16P2.61KBCT-ND; Technology: Metal Film; AEC Qualified: ?; ComponentLink1URL: http://www.susumu.co.jp/english/pdf/products-j01-01.pdf
R138 R139 R144-R146 R148 = CMP-0025786-4: RES, 33 k, 5%, 0.1 W, AEC-Q200 Grade 0, 0603; PartNumber: CRCW060333K0JNEA; Manufacturer: Vishay-Dale; Value: 33k; Value_Code: 33k0; Power_W: 100mW; Value2: 0.1W; VDC_V: 75V; TempCo: 200 ppm/C; EIA_Code: E24; AEC Category: Q200; AEC Qualified: Y; AEC Grade: 0; SizeArea_mm2: 1.28; SizeX_mm: 1.6; SizeY_mm: 0.8; SizeZ_mm: 1; CompType: Resistor; PackageReference: 0603; RoHS: E; Res_ohm: 33k; Tolerance_%: 5%; Value1: 5%; MountType: SMT; Technology: Thick Film; ComponentLink1Description: Datasheet link; ComponentLink1URL: http://www.vishay.com/docs/20035/dcrcwe3.pdf; Supplier 1: Digi-Key; Supplier Part Number 1: 541-33KGCT-ND; Supplier 2: Newark; Supplier Part Number 2: 59M6802; Supplier 3: Mouser; Supplier Part Number 3: 71-CRCW0603J-33K-E3
R143 = CMP-0022734-3: RES, 33.0 k, 1%, 0.125 W, 0603; Manufacturer: Vishay/Beyschlag; Power_W: 125mW; TempCo: 50 ppm/C; Value_Code: 33k0; U/M: EA; Value: 33.0k; Res_ohm: 33k; SizeX_mm: 1.6; SizeY_mm: 0.8; SizeZ_mm: 1; Value2: 0.125W; SizeArea_mm2: 1.28; CompType: Resistor; AEC Qualified: N; VDC_V: 75V; AEC Category: Q200; Supplier Part Number 2: 96Y9426; Publisher: Texas Instruments; Supplier 2: Newark; Supplier Part Number 3: 594-MCT06030C3302FP5; Supplier 3: Mouser; Published: 2008-06-26; RoHS: Y; Value1: 1%; MountType: SMT; Supplier 1: Digi-Key; PackageReference: 0603; Tolerance_%: 1%; LatestRevisionDate: 2017-03-09; PartNumber: MCT06030C3302FP500; ComponentLink1Description: Datasheet link; AEC Grade: N/A; Supplier Part Number 1: MCT0603-33.0K-CFCT-ND; Technology: Thin Film; ComponentLink1URL: http://www.vishay.com/docs/28705/mcx0x0xpro.pdf
R147 = CMP-0023581-3: RES, 6.04 k, 0.1%, 0.1 W, 0603; Manufacturer: Susumu Co Ltd; Power_W: 100mW; TempCo: 25 ppm/C; Value_Code: 6k04; U/M: EA; Value: 6.04k; EIA_Code: E192; SizeX_mm: 1.6; SizeY_mm: 0.8; SizeZ_mm: 1; Value2: 0.1W; SizeArea_mm2: 1.28; CompType: Resistor; VDC_V: 75V; AEC Category: Q200; Supplier Part Number 2: 754-RG1608P-6041-BT5; Publisher: Texas Instruments; Supplier 2: Mouser; Published: 2008-06-26; RoHS: Y; Value1: 0.1%; MountType: SMT; Supplier 1: Digi-Key; PackageReference: 0603; Tolerance_%: 0.1%; Res_ohm: 6.04k; LatestRevisionDate: 2017-03-09; PartNumber: RG1608P-6041-B-T5; AEC Qualified: ?; ComponentLink1Description: Datasheet link; Supplier Part Number 1: RG16P6.04KBCT-ND; Technology: Metal Film; ComponentLink1URL: http://www.susumu.co.jp/english/pdf/products-j01-01.pdf
TP19 TP23 TP30-TP32 = CMP-0003825-1: 1mm Test Point, SMT; Manufacturer: Any; ComponentLink1URL: https://sps06.itg.ti.com/sites/KMS/crossdivteams/altium/docs/ComponentDatasheets/PROBE_TEST_POINT.png; Key: TP_SM_1MM; Publisher: Texas Instruments; CompType: Test Point; PackageReference: 1mm Test Point, SMT; LatestRevisionDate: 2017-03-09; MountType: SMT; PartNumber: TP_SM_1MM; ComponentLink1Description: Datasheet Link
TP20-TP22 TP24-TP29 = CMP-0055139-1: Test Point, Miniature, White, TH; Manufacturer: Keystone; ContactFinish: Silver; CNHeader: FALSE; CT: TRUE; Green_Lifecycle: Active; Green_REACh: Passed; PartNumber: 5002; PackageReference: White Miniature Testpoint; CompType: Test Point; RoHS: Y; MountType: TH; ComponentLink1Description: Datasheet URL; ComponentLink1URL: http://www.keyelco.com/userAssets/file/M60-2p60.pdf; Publisher: Texas Instruments; LatestRevisionDate: 26/05/2017; Supplier 1: Digi-Key; Supplier Part Number 1: 36-5002-ND; Supplier 2: Newark; Supplier Part Number 2: 82H9632; Supplier 3: Mouser; Supplier Part Number 3: 534-5002; Color: White; Green_EU RoHS-2: Passed; Green_EU RoHS: Passed
TP35 TP36 = CMP-0075110-1: 1mm Uninsulated Shorting Plug, 10.16mm spacing, TH; Manufacturer: Harwin; CompType: Jumper Wire; CNHeader: False; Green_Lifecycle: Active; Green_REACh: Passed; PartNumber: D3082-05; PackageReference: Shorting Plug, 10.16mm spacing, TH; RoHS: Y; MountType: TH; ComponentLink1Description: Datasheet URL; ComponentLink1URL: http://cdn.harwin.com/pdfs/D3080-D3083.pdf; Publisher: Texas Instruments; LatestRevisionDate: 2017-07-12; Supplier 1: Digi-Key; Supplier Part Number 1: 952-1873-ND; Supplier 2: Newark; Supplier Part Number 2: 01E9240; Supplier 3: Mouser; Supplier Part Number 3: 855-D3082-05; CT: False; Green_EU RoHS-2: Passed; Green_EU RoHS: Passed with Exemption
U4 = CMP-0013782-2: 100-V Three-Phase Smart Gate Driver, RGZ0048L (VQFN-48); Alternate PartNumber: DRV8353RSRGZT; Manufacturer: Texas Instruments; SizeArea_mm2: 49; SizeAreaWB_mm2: 81; SizeX_mm: 7; SizeZ_mm: 1; CompType: IC; U/M: EA; PartNumber: DRV8353RSRGZR; PackageReference: RGZ0048L; PackageDescription: VQFN-48; MountType: SMT; SizeY_mm: 7; ComponentLink1Description: Datasheet Link; ComponentLink1URL: https://sps06.itg.ti.com/sites/KMS/crossdivteams/altium/docs/ComponentDatasheets/DRV835x_120116.pdf; Publisher: Texas Instruments; LatestRevisionDate: 2017-03-09; Alternate Manufacturer: Texas Instruments
U5 = CMP-0043121-2: ESD Solution for High-Speed Differential Interface, 4 Channels, -40 to +85 degC,10-pin SON (DQA), Green (RoHS & no Sb/Br); Manufacturer: Texas Instruments; IO Leakage Current(nA): 10; IO Capacitance(Typ)(pF): 0.8; 1394 / Firewire: TRUE; Breakdown Voltage(Min)(V): 9; Differential Capacitance(pF): 0.05; IEC 61000-4-2 Contact(+/- kV): 8; ComponentLink1URL: http://www.ti.com/; PackageDescription: 10-Pin Plastic Small Outline No-Lead, 1 x 2.5 x 0.55 mm Body, 0.5 mm Pitch; ComponentLink2URL: http://www.ti.com/general/docs/lit/getliterature.tsp?genericPartNumber=TPD4S010&fileType=pdf; Serial ATA / eSATA: TRUE; ComponentLink3Description: URL Link1; Eco-Plan: Green (RoHS & no Sb/Br); ComponentLink2Description: Datasheet; ComponentLink3URL: SamplesURL:http://www.ti.com/product/tpd4s010#samples; PackageReference: DQA0010A; DatasheetVersion: SLVS817E; SubFamily: ESD Solution; PartNumber: TPD4S010DQAR; PackageVersion: revB, Sep-2009; Mounting Technology: Surface Mount; ComponentLink1Description: Manufacturer URL; IEC 61000-4-2 Air-Gap(+/- kV): 9
U6 = TPS7A2550DRVR: Manufacturer: Texas Instruments; Supplier 1: Digi-Key; Manufacturer Part Number: TPS7A2550DRVR; RoHS: No; Stock 1: 2885; Pricing 1: 1=1,28000, 10=1,14200, 25=1,08360, 100=0,83210, 250=0,73532, 500=0,69660, 1000=0,54180 (USD); Supplier Part Number 1: 296-TPS7A2550DRVRCT-ND